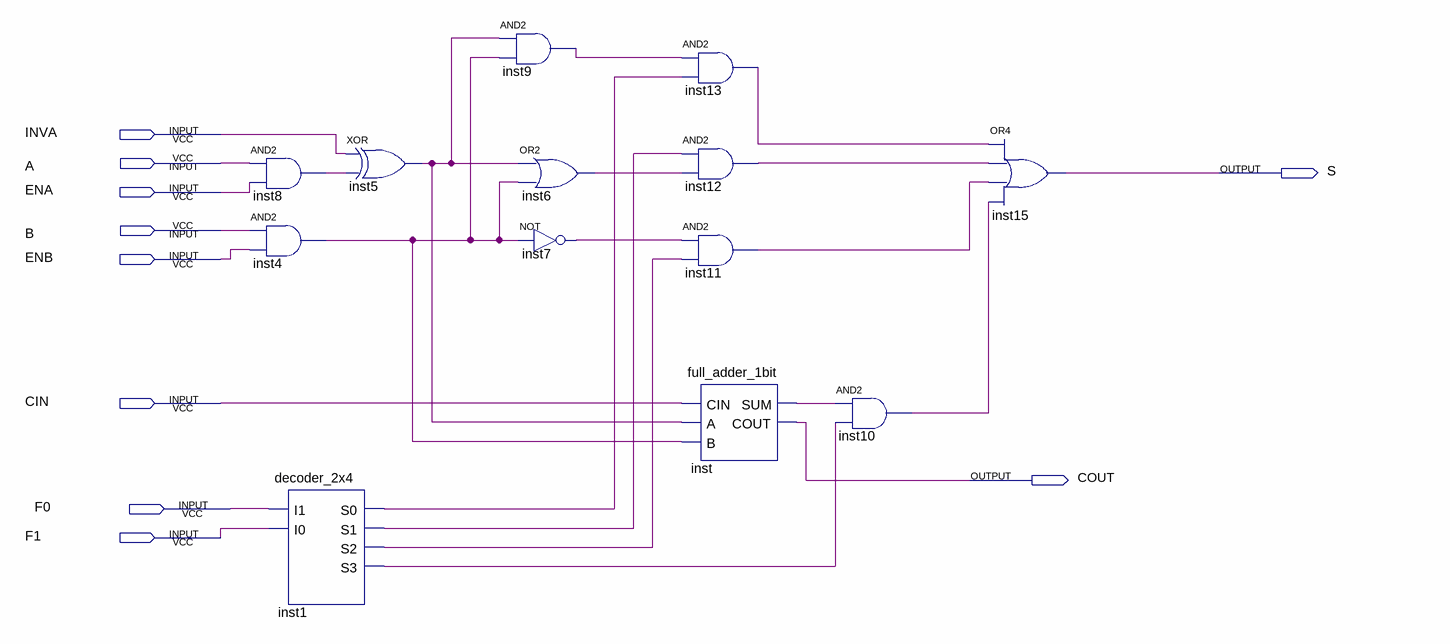
[diagram p0: schematic sheet]
// Quartus schematic ula_1bit.bdf as structural Verilog: 13 symbols, 10 pins
module ula_1bit (
  input  INVA,
  input  A,
  input  ENA,
  input  B,
  input  ENB,
  input  CIN,
  input  F0,
  input  F1,
  output S,
  output COUT
);

  wire inst1_s0, inst1_s1, inst1_s2, inst1_s3, inst4_out, inst5_out, inst6_out, inst7_out, inst8_out,
       inst9_out, inst10_out, inst11_out, inst12_out, inst13_out, inst_sum;

  and inst8 (inst8_out, A, ENA);
  and inst4 (inst4_out, B, ENB);
  decoder_2x4 inst1 (.I1(F0), .I0(F1), .S0(inst1_s0), .S1(inst1_s1), .S2(inst1_s2), .S3(inst1_s3));
  xor inst5 (inst5_out, INVA, inst8_out);
  and inst9 (inst9_out, inst5_out, inst4_out);
  or inst6 (inst6_out, inst5_out, inst4_out);
  not inst7 (inst7_out, inst4_out);
  and inst13 (inst13_out, inst9_out, inst1_s0);
  and inst12 (inst12_out, inst1_s1, inst6_out);
  and inst11 (inst11_out, inst7_out, inst1_s2);
  full_adder_1bit inst (.CIN(CIN), .A(inst5_out), .B(inst4_out), .SUM(inst_sum), .COUT(COUT));
  and inst10 (inst10_out, inst_sum, inst1_s3);
  or inst15 (S, inst13_out, inst12_out, inst11_out, inst10_out);
endmodule
